# Altium schematic sheet cOMBO.SchDoc
size A4
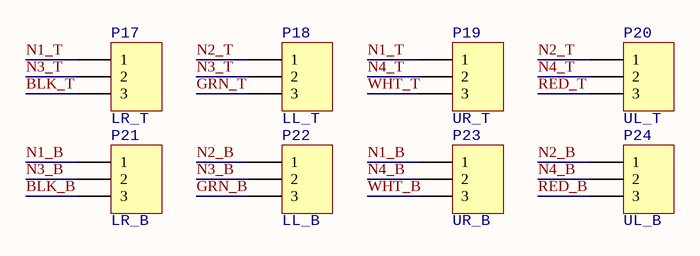
[diagram p0: cOMBO.SchDoc]

## Parts
P17  LR_T  [HDR1X3]
P18  LL_T  [HDR1X3]
P19  UR_T  [HDR1X3]
P20  UL_T  [HDR1X3]
P21  LR_B  [HDR1X3]
P22  LL_B  [HDR1X3]
P23  UR_B  [HDR1X3]
P24  UL_B  [HDR1X3]

## Nets
BLK_B: P21.3
BLK_T: P17.3
GRN_B: P22.3
GRN_T: P18.3
N1_B: P21.1 P23.1
N1_T: P17.1 P19.1
N2_B: P22.1 P24.1
N2_T: P18.1 P20.1
N3_B: P21.2 P22.2
N3_T: P17.2 P18.2
N4_B: P23.2 P24.2
N4_T: P19.2 P20.2
RED_B: P24.3
RED_T: P20.3
WHT_B: P23.3
WHT_T: P19.3

## Library data of the parts
P17-P24 = Header 3: Header, 3-Pin; LatestRevisionDate: 17-Jul-2002; LatestRevisionNote: Re-released for DXP Platform.; Publisher: Altium Limited